# Altium schematic sheet microsmt_pnpboard_v17_sheet_1.schdoc
size 853 x 579 mm
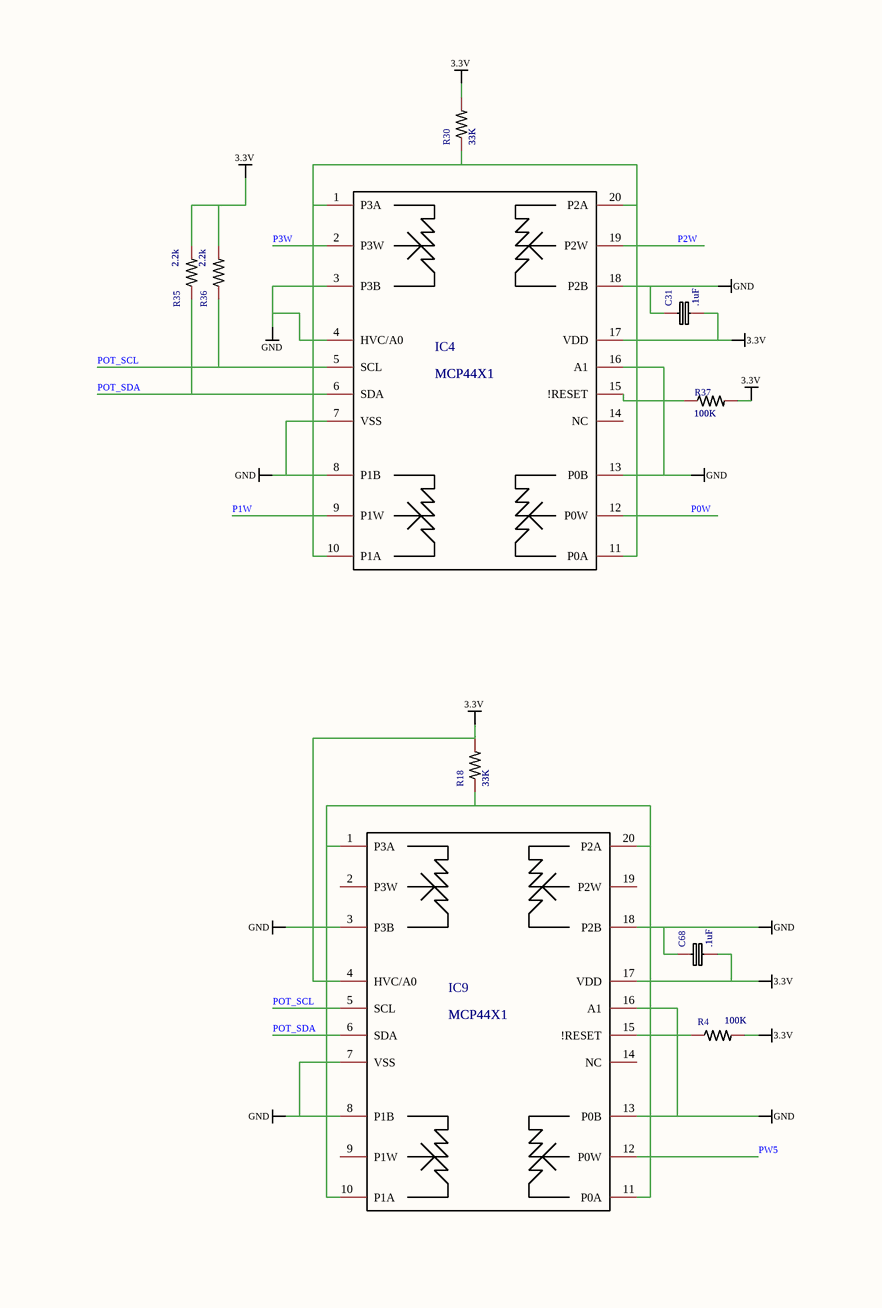
[diagram p0: microsmt_pnpboard_v17_sheet_1.schdoc, top middle]
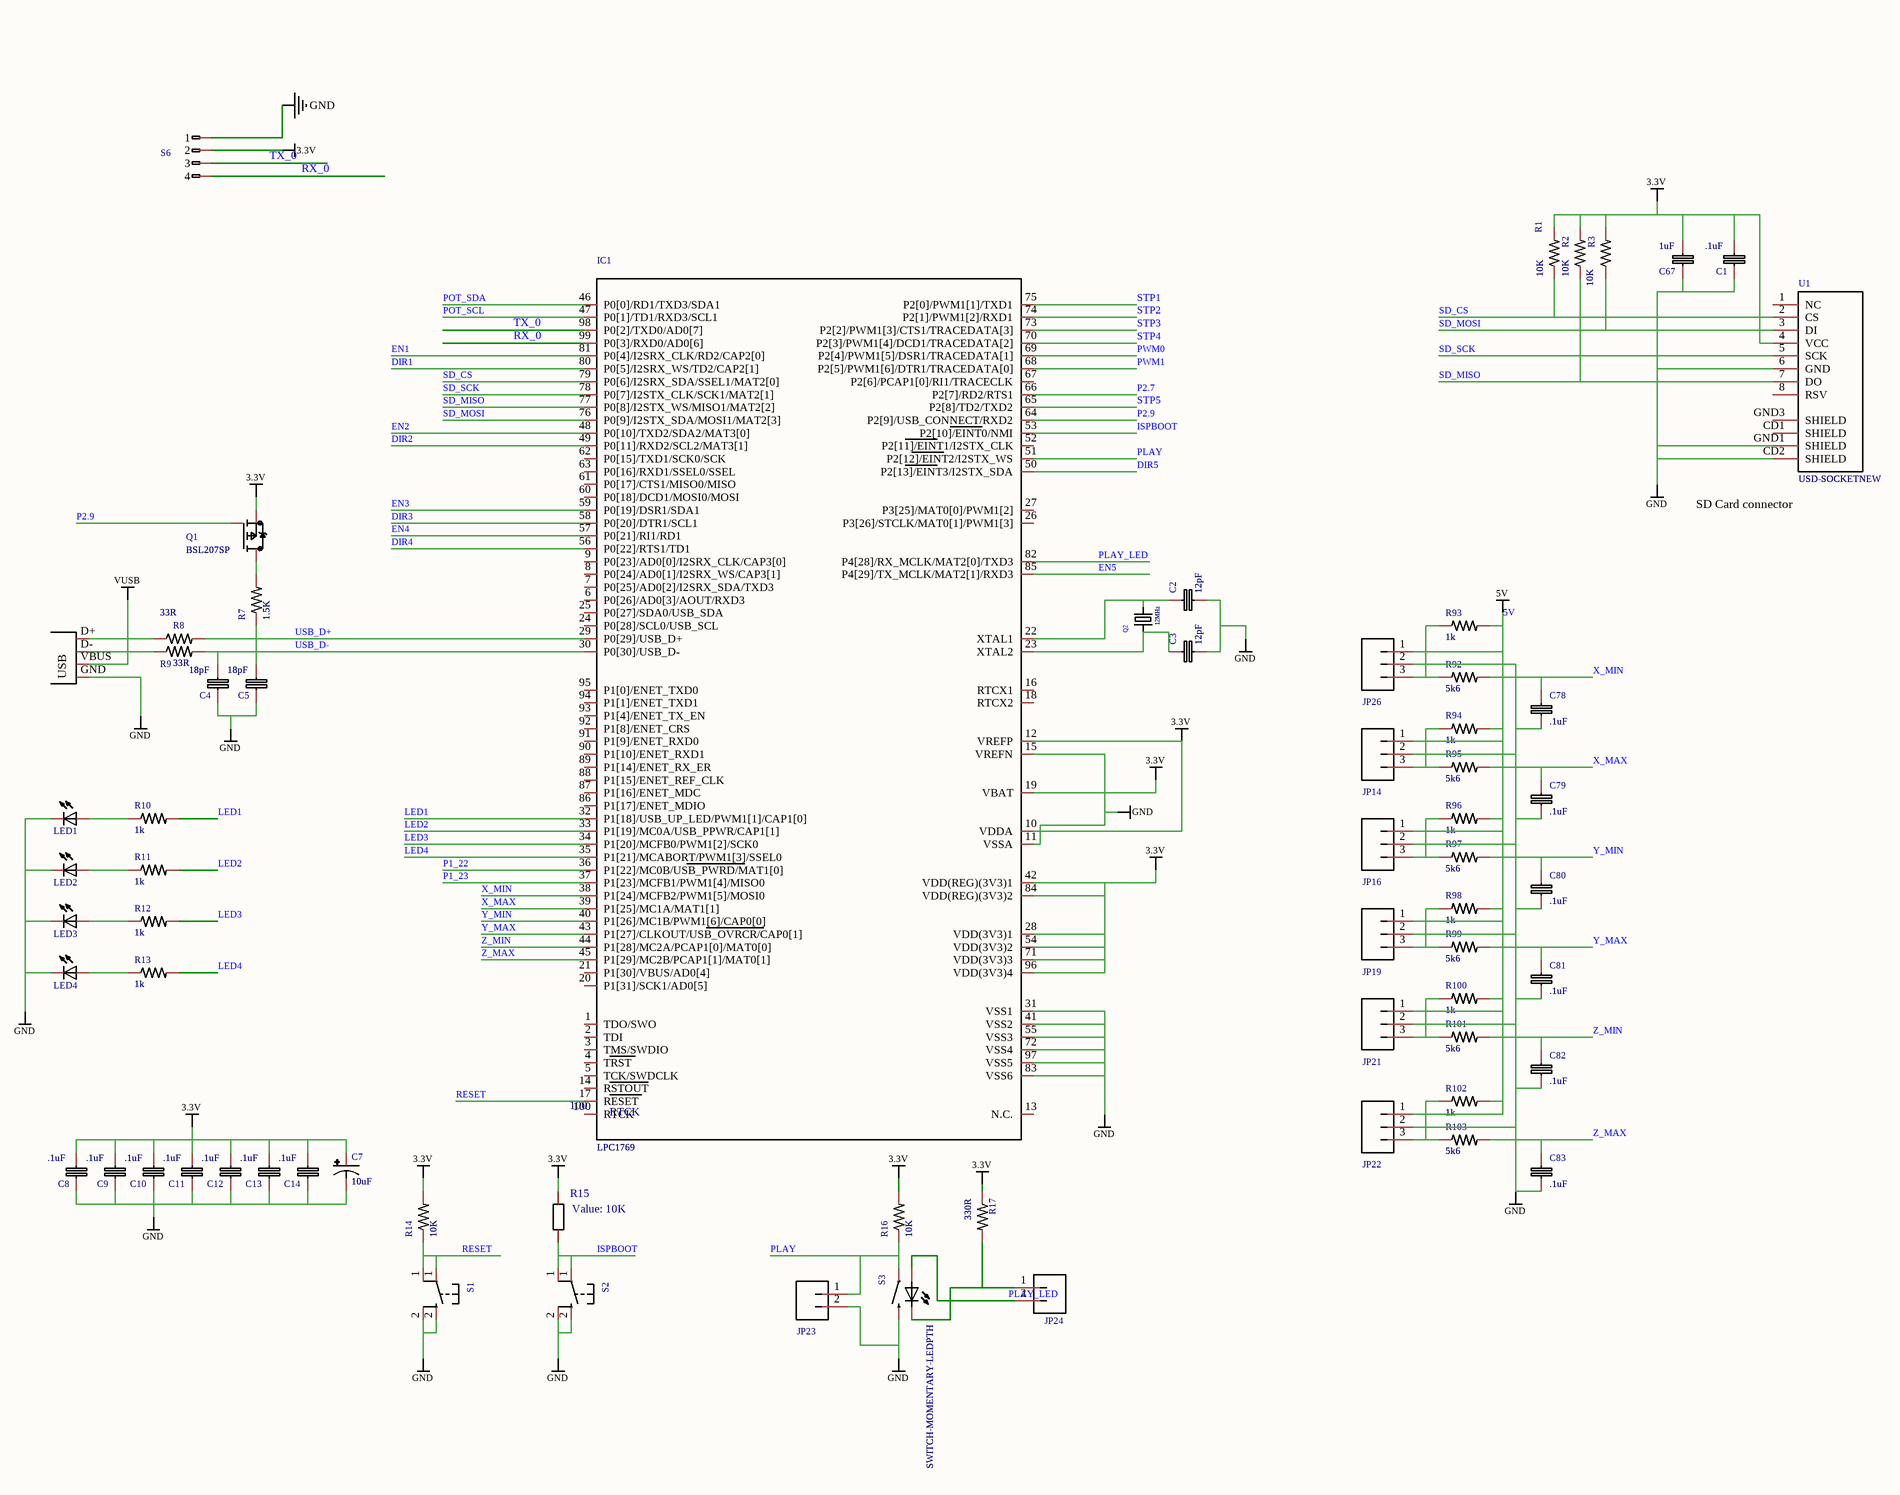
[diagram p1: microsmt_pnpboard_v17_sheet_1.schdoc, top right]
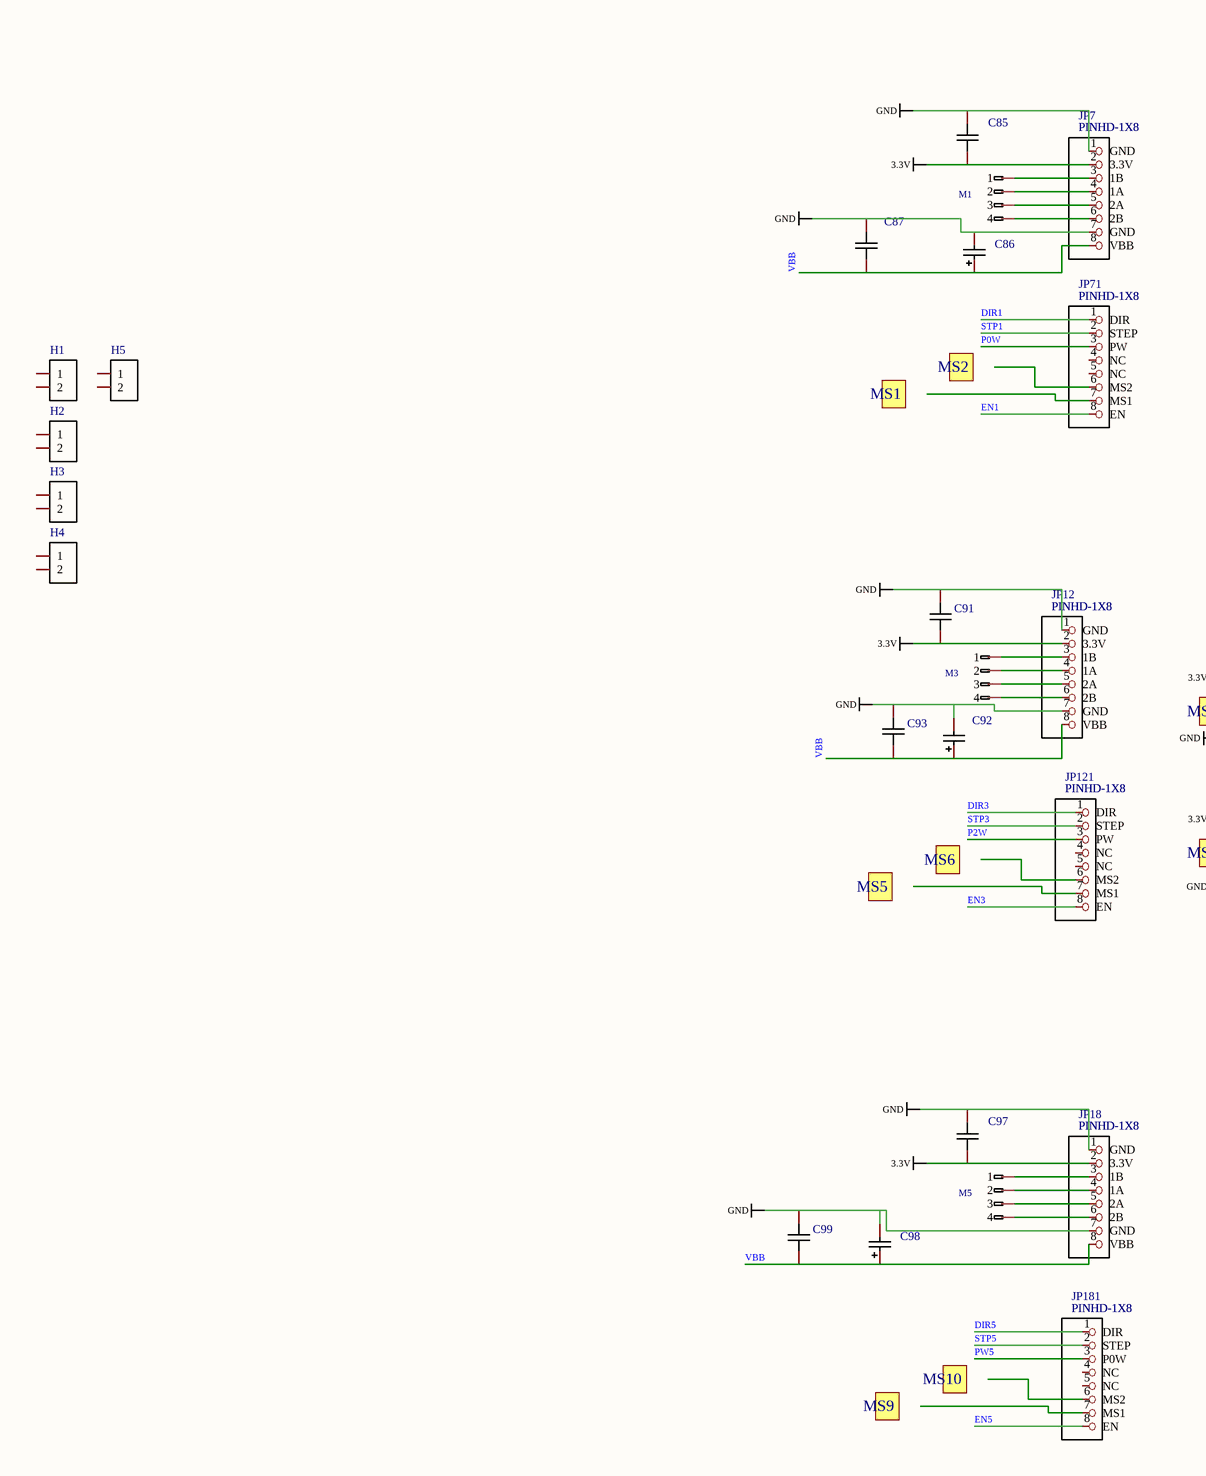
[diagram p2: microsmt_pnpboard_v17_sheet_1.schdoc, bottom left]
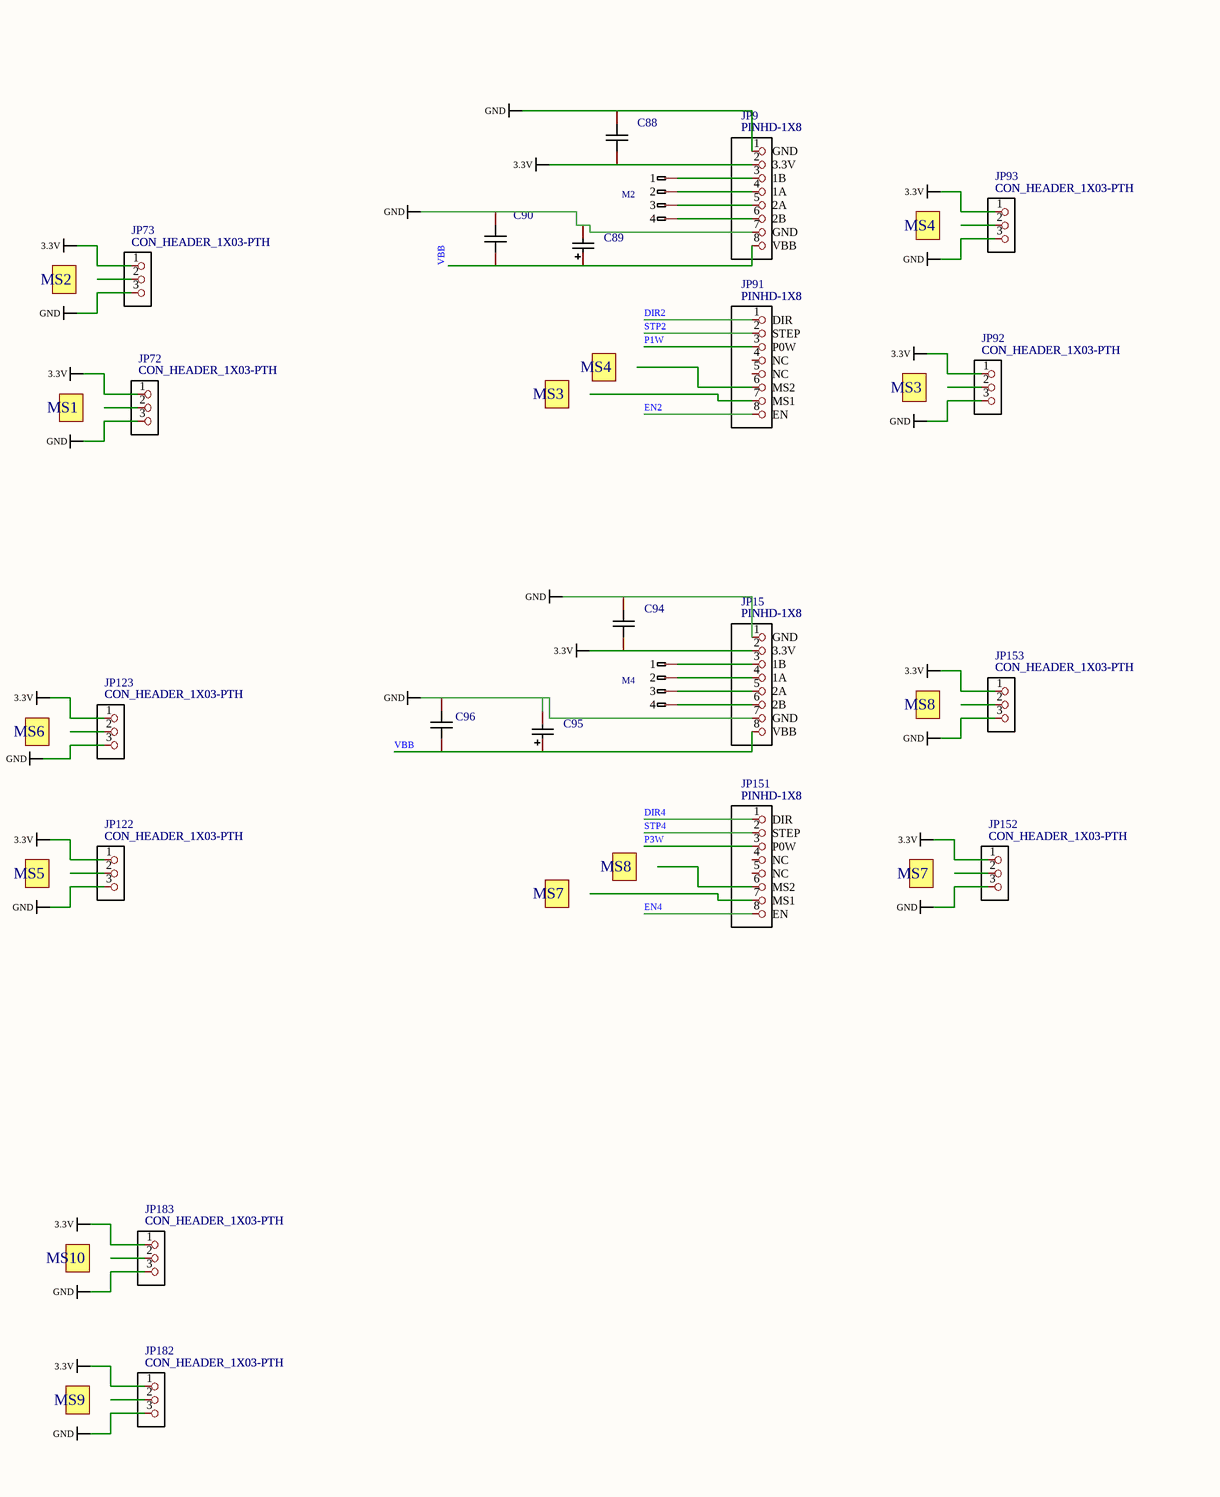
[diagram p3: microsmt_pnpboard_v17_sheet_1.schdoc, bottom middle]

## Parts
C1  .1uF  [R0603]
C2  12pF  [R0603]
C3  12pF  [R0603]
C4  18pF  [R0603]
C5  18pF  [R0603]
C7  10uF  [EIA3216]
C8  .1uF  [R0603]
C9  .1uF  [R0603]
C10  .1uF  [R0603]
C11  .1uF  [R0603]
C12  .1uF  [R0603]
C13  .1uF  [R0603]
C14  .1uF  [R0603]
C31  .1uF  [R0603]
C67  1uF  [R0603]
C68  .1uF  [R0603]
C78  .1uF  [R0603]
C79  .1uF  [R0603]
C80  .1uF  [R0603]
C81  .1uF  [R0603]
C82  .1uF  [R0603]
C83  .1uF  [R0603]
C85  100nF  [R0603]  (value not drawn)
C86  100uF  [贴片铝电解8*10.5]  (value not drawn)
C87  100nF  [R0603]  (value not drawn)
C88  100nF  [R0603]  (value not drawn)
C89  100uF  [贴片铝电解8*10.5]  (value not drawn)
C90  CAP_0603  [R0603]  (value not drawn)
C91  CAP_0603  [R0603]  (value not drawn)
C92  C_Ele_SMD_3x5.4mm  [贴片铝电解8*10.5]  (value not drawn)
C93  100nF  [R0603]  (value not drawn)
C94  100nF  [R0603]  (value not drawn)
C95  100uF  [贴片铝电解8*10.5]  (value not drawn)
C96  100nF  [R0603]  (value not drawn)
C97  100nF  [R0603]  (value not drawn)
C98  100uF  [贴片铝电解8*10.5]  (value not drawn)
C99  100nF  [R0603]  (value not drawn)
H1  HDR-F_2.54_1x2P  [HDR-TH_2P-P2.54-V-F]  (value not drawn)
H2  HDR-F_2.54_1x2P  [HDR-TH_2P-P2.54-V-F]  (value not drawn)
H3  HDR-F_2.54_1x2P  [HDR-TH_2P-P2.54-V-F]  (value not drawn)
H4  HDR-F_2.54_1x2P  [HDR-TH_2P-P2.54-V-F]  (value not drawn)
H5  HDR-F_2.54_1x2P  [HDR-TH_2P-P2.54-V-F]  (value not drawn)
IC1  LPC1769  NAME: RTCK  NUMBER: 100  [LQFP100_14X14]
IC4  MCP44X1  [TSSOP-20_L6.5-W4.4-P0.65-LS6.4-TL]
IC9  MCP44X1  [TSSOP-20_L6.5-W4.4-P0.65-LS6.4-TL]
JP7  PINHD-1X8  [1X08-BIG]
JP9  PINHD-1X8  [1X08-BIG]
JP12  PINHD-1X8  [1X08-BIG]
JP14  M03POLAR  [MOLEX-1X3]  (value not drawn)
JP15  PINHD-1X8  [1X08-BIG]
JP16  M03POLAR  [MOLEX-1X3]  (value not drawn)
JP18  PINHD-1X8  [1X08-BIG]
JP19  M03POLAR  [MOLEX-1X3]  (value not drawn)
JP21  M03POLAR  [MOLEX-1X3]  (value not drawn)
JP22  M03POLAR  [MOLEX-1X3]  (value not drawn)
JP23  M02PTH  [MOLEX-1X2]  (value not drawn)
JP24  M02PTH  [MOLEX-1X2]  (value not drawn)
JP26  M03POLAR  [MOLEX-1X3]  (value not drawn)
JP71  PINHD-1X8  [1X08-BIG]
JP72  CON_HEADER_1X03-PTH  [1X03_NO_SILK]
JP73  CON_HEADER_1X03-PTH  [1X03_NO_SILK]
JP91  PINHD-1X8  [1X08-BIG]
JP92  CON_HEADER_1X03-PTH  [1X03_NO_SILK]
JP93  CON_HEADER_1X03-PTH  [1X03_NO_SILK]
JP121  PINHD-1X8  [1X08-BIG]
JP122  CON_HEADER_1X03-PTH  [1X03_NO_SILK]
JP123  CON_HEADER_1X03-PTH  [1X03_NO_SILK]
JP151  PINHD-1X8  [1X08-BIG]
JP152  CON_HEADER_1X03-PTH  [1X03_NO_SILK]
JP153  CON_HEADER_1X03-PTH  [1X03_NO_SILK]
JP181  PINHD-1X8  [1X08-BIG]
JP182  CON_HEADER_1X03-PTH  [1X03_NO_SILK]
JP183  CON_HEADER_1X03-PTH  [1X03_NO_SILK]
LED1  LEDCHIP-LED0805  [LED0805-RD]  (value not drawn)
LED2  LEDCHIP-LED0805  [LED0805-RD]  (value not drawn)
LED3  LEDCHIP-LED0805  [LED0805-RD]  (value not drawn)
LED4  LEDCHIP-LED0805  [LED0805-RD]  (value not drawn)
M1  10X04MTA  [10X04MTA]  (value not drawn)
M2  10X04MTA  [10X04MTA]  (value not drawn)
M3  10X04MTA  [10X04MTA]  (value not drawn)
M4  10X04MTA  [10X04MTA]  (value not drawn)
M5  10X04MTA  [10X04MTA]  (value not drawn)
Q1  BSL207SP  [TSOP-6_L3.0-W1.5-P0.95-LS2.8-BL]
Q2  12MHz  [3.2*2.5_3225贴片无源晶振]
R1  10K  [R0603]
R2  10K  [R0603]
R3  10K  [R0603]
R4  100K  [R0603]
R7  1.5K  [R0603]
R8  33R  [R0603]
R9  33R  [R0603]
R10  1k  [R0603]
R11  1k  [R0603]
R12  1k  [R0603]
R13  1k  [R0603]
R14  10K  [R0603]
R15  value 10K  [R0603]  (hidden comment: Res_0603)
R16  10K  [R0603]
R17  330R  [R0603]
R18  33K  [R0603]
R30  33K  [R0603]
R35  2.2k  [R0603]
R36  2.2k  [R0603]
R37  100K  [R0603]
R92  5k6  [R0603]
R93  1k  [R0603]
R94  1k  [R0603]
R95  5k6  [R0603]
R96  1k  [R0603]
R97  5k6  [R0603]
R98  1k  [R0603]
R99  5k6  [R0603]
R100  1k  [R0603]
R101  5k6  [R0603]
R102  1k  [R0603]
R103  5k6  [R0603]
S1  TAC_SWITCHSMD  [SW_SPST_B3S-1000]  (value not drawn)
S2  TAC_SWITCHSMD  [SW_SPST_B3S-1000]  (value not drawn)
S3  SWITCH-MOMENTARY-LEDPTH  [TACTILE-PTH-LED-12MM]
S6  10X04MTA  [10X04MTA]  (value not drawn)
U1  USD-SOCKETNEW  [MICRO-SD-SOCKET-PP]
X14  USBPTH  [USB-B-PTH]  (value not drawn)

## Ports
MS1 (out), MS2 (out), MS3 (out), MS4 (out), MS5 (out), MS6 (out), MS7 (out), MS8 (out), MS9 (out), MS10 (out)

## Nets
3.3V: C1.2 C7.A(+) C8.2 C9.2 C10.2 C11.2 C12.2 C13.2 C14.2 C31.2 C67.2 C68.2 C85.1 C88.1 C91.1 C94.1 C97.1 IC1.10(VDDA) IC1.12(VREFP) IC1.19(VBAT) IC1.28(VDD(3V3)1) IC1.42(VDD(REG)(3V3)1) IC1.54(VDD(3V3)2) IC1.71(VDD(3V3)3) IC1.84(VDD(REG)(3V3)2) IC1.96(VDD(3V3)4) IC4.17(VDD) IC9.4(HVC/A0) IC9.17(VDD) JP7.2(3.3V) JP9.2(3.3V) JP12.2(3.3V) JP15.2(3.3V) JP18.2(3.3V) JP72.1 JP73.1 JP92.1 JP93.1 JP122.1 JP123.1 JP152.1 JP153.1 JP182.1 JP183.1 Q1.4(S) R1.2 R2.2 R3.2 R4.2 R14.2 R15.2 R16.2 R17.1 R18.2 R30.2 R35.2 R36.2 R37.2 S6.2 U1.4(VCC)
5V: JP14.1 JP16.1 JP19.1 JP21.1 JP22.1 JP26.1 R93.2 R94.2 R96.2 R98.2 R100.2 R102.2
GND: C1.1 C2.2 C3.2 C4.1 C5.1 C7.C(-) C8.1 C9.1 C10.1 C11.1 C12.1 C13.1 C14.1 C31.1 C67.1 C68.1 C78.2 C79.2 C80.2 C81.2 C82.2 C83.2 C85.2 C86.2 C87.2 C88.2 C89.2 C90.2 C91.2 C92.2 C93.2 C94.2 C95.2 C96.2 C97.2 C98.2 C99.2 IC1.11(VSSA) IC1.15(VREFN) IC1.31(VSS1) IC1.41(VSS2) IC1.55(VSS3) IC1.72(VSS4) IC1.83(VSS6) IC1.97(VSS5) IC4.3(P3B) IC4.4(HVC/A0) IC4.7(VSS) IC4.8(P1B) IC4.13(P0B) IC4.16(A1) IC4.18(P2B) IC9.3(P3B) IC9.7(VSS) IC9.8(P1B) IC9.13(P0B) IC9.16(A1) IC9.18(P2B) JP7.1(GND) JP7.7(GND) JP9.1(GND) JP9.7(GND) JP12.1(GND) JP12.7(GND) JP14.2 JP15.1(GND) JP15.7(GND) JP16.2 JP18.1(GND) JP18.7(GND) JP19.2 JP21.2 JP22.2 JP23.2 JP26.2 JP72.3 JP73.3 JP92.3 JP93.3 JP122.3 JP123.3 JP152.3 JP153.3 JP182.3 JP183.3 LED1.1 LED2.1 LED3.1 LED4.1 S1.2 S2.2 S3.2 S6.1 U1.6(GND) U1.CD2(SHIELD) U1.GND1(SHIELD) X14.GND
VUSB: X14.VBUS
DIR1: IC1.80(P0[5]/I2SRX_WS/TD2/CAP2[1]) JP71.1(DIR)
DIR2: IC1.49(P0[11]/RXD2/SCL2/MAT3[1]) JP91.1(DIR)
DIR3: IC1.58(P0[20]/DTR1/SCL1) JP121.1(DIR)
DIR4: IC1.56(P0[22]/RTS1/TD1) JP151.1(DIR)
DIR5: IC1.50(P2[13]/EINT3/I2STX_SDA) JP181.1(DIR)
EN1: IC1.81(P0[4]/I2SRX_CLK/RD2/CAP2[0]) JP71.8(EN)
EN2: IC1.48(P0[10]/TXD2/SDA2/MAT3[0]) JP91.8(EN)
EN3: IC1.59(P0[19]/DSR1/SDA1) JP121.8(EN)
EN4: IC1.57(P0[21]/RI1/RD1) JP151.8(EN)
EN5: IC1.85(P4[29]/TX_MCLK/MAT2[1]/RXD3) JP181.8(EN)
ISPBOOT: IC1.53(P2[10]/EINT0/NMI) R15.1 S2.1
LED1: IC1.32(P1[18]/USB_UP_LED/PWM1[1]/CAP1[0]) R10.2
LED2: IC1.33(P1[19]/MC0A/USB_PPWR/CAP1[1]) R11.2
LED3: IC1.34(P1[20]/MCFB0/PWM1[2]/SCK0) R12.2
LED4: IC1.35(P1[21]/MCABORT/PWM1[3]/SSEL0) R13.2
P0W: IC4.12(P0W) JP71.3(PW)
P1_22: IC1.36(P1[22]/MC0B/USB_PWRD/MAT1[0])
P1_23: IC1.37(P1[23]/MCFB1/PWM1[4]/MISO0)
P1W: IC4.9(P1W) JP91.3(P0W)
P2.7: IC1.66(P2[7]/RD2/RTS1)
P2.9: IC1.64(P2[9]/USB_CONNECT/RXD2) Q1.3(G)
P2W: IC4.19(P2W) JP121.3(PW)
P3W: IC4.2(P3W) JP151.3(P0W)
PLAY: IC1.51(P2[12]/EINT2/I2STX_WS) JP23.1 R16.1 S3.4
PLAY_LED: IC1.82(P4[28]/RX_MCLK/MAT2[0]/TXD3) JP24.2 S3.A
POT_SCL: IC1.47(P0[1]/TD1/RXD3/SCL1) IC4.5(SCL) IC9.5(SCL) R36.1
POT_SDA: IC1.46(P0[0]/RD1/TXD3/SDA1) IC4.6(SDA) IC9.6(SDA) R35.1
PW5: IC9.12(P0W) JP181.3(P0W)
PWM0: IC1.69(P2[4]/PWM1[5]/DSR1/TRACEDATA[1])
PWM1: IC1.68(P2[5]/PWM1[6]/DTR1/TRACEDATA[0])
RESET: IC1.17(RESET) R14.1 S1.1
RX_0: IC1.99(P0[3]/RXD0/AD0[6]) S6.4
SD_CS: IC1.79(P0[6]/I2SRX_SDA/SSEL1/MAT2[0]) R1.1 U1.2(CS)
SD_MISO: IC1.77(P0[8]/I2STX_WS/MISO1/MAT2[2]) R2.1 U1.7(DO)
SD_MOSI: IC1.76(P0[9]/I2STX_SDA/MOSI1/MAT2[3]) R3.1 U1.3(DI)
SD_SCK: IC1.78(P0[7]/I2STX_CLK/SCK1/MAT2[1]) U1.5(SCK)
STP1: IC1.75(P2[0]/PWM1[1]/TXD1) JP71.2(STEP)
STP2: IC1.74(P2[1]/PWM1[2]/RXD1) JP91.2(STEP)
STP3: IC1.73(P2[2]/PWM1[3]/CTS1/TRACEDATA[3]) JP121.2(STEP)
STP4: IC1.70(P2[3]/PWM1[4]/DCD1/TRACEDATA[2]) JP151.2(STEP)
STP5: IC1.65(P2[8]/TD2/TXD2) JP181.2(STEP)
TX_0: IC1.98(P0[2]/TXD0/AD0[7]) S6.3
USB_D+: C5.2 IC1.29(P0[29]/USB_D+) R7.1 R8.2
USB_D-: C4.2 IC1.30(P0[30]/USB_D-) R9.2
VBB: C86.1 C87.1 C89.1 C90.1 C92.1 C93.1 C95.1 C96.1 C98.1 C99.1 JP7.8(VBB) JP9.8(VBB) JP12.8(VBB) JP15.8(VBB) JP18.8(VBB)
X_MAX: C79.1 IC1.39(P1[25]/MC1A/MAT1[1]) R95.2
X_MIN: C78.1 IC1.38(P1[24]/MCFB2/PWM1[5]/MOSI0) R92.2
Y_MAX: C81.1 IC1.43(P1[27]/CLKOUT/USB_OVRCR/CAP0[1]) R99.2
Y_MIN: C80.1 IC1.40(P1[26]/MC1B/PWM1[6]/CAP0[0]) R97.2
Z_MAX: C83.1 IC1.45(P1[29]/MC2B/PCAP1[1]/MAT0[1]) R103.2
Z_MIN: C82.1 IC1.44(P1[28]/MC2A/PCAP1[0]/MAT0[0]) R101.2
NetC2_1: C2.1 IC1.22(XTAL1) Q2.3
NetC3_1: C3.1 IC1.23(XTAL2) Q2.1
NetIC4_1: IC4.1(P3A) IC4.10(P1A) IC4.11(P0A) IC4.20(P2A) R30.1
NetIC4_15: IC4.15(!RESET) R37.1
NetIC9_1: IC9.1(P3A) IC9.10(P1A) IC9.11(P0A) IC9.20(P2A) R18.1
NetIC9_15: IC9.15(!RESET) R4.1
NetJP7_3: JP7.3(1B) M1.1
NetJP7_4: JP7.4(1A) M1.2
NetJP7_5: JP7.5(2A) M1.3
NetJP7_6: JP7.6(2B) M1.4
NetJP9_3: JP9.3(1B) M2.1
NetJP9_4: JP9.4(1A) M2.2
NetJP9_5: JP9.5(2A) M2.3
NetJP9_6: JP9.6(2B) M2.4
NetJP12_3: JP12.3(1B) M3.1
NetJP12_4: JP12.4(1A) M3.2
NetJP12_5: JP12.5(2A) M3.3
NetJP12_6: JP12.6(2B) M3.4
NetJP14_3: JP14.3 R94.1 R95.1
NetJP15_3: JP15.3(1B) M4.1
NetJP15_4: JP15.4(1A) M4.2
NetJP15_5: JP15.5(2A) M4.3
NetJP15_6: JP15.6(2B) M4.4
NetJP16_3: JP16.3 R96.1 R97.1
NetJP18_3: JP18.3(1B) M5.1
NetJP18_4: JP18.4(1A) M5.2
NetJP18_5: JP18.5(2A) M5.3
NetJP18_6: JP18.6(2B) M5.4
NetJP19_3: JP19.3 R98.1 R99.1
NetJP21_3: JP21.3 R100.1 R101.1
NetJP22_3: JP22.3 R102.1 R103.1
NetJP24_1: JP24.1 R17.2 S3.C
NetJP26_3: JP26.3 R92.1 R93.1
NetLED1_2: LED1.2 R10.1
NetLED2_2: LED2.2 R11.1
NetLED3_2: LED3.2 R12.1
NetLED4_2: LED4.2 R13.1
NetQ1_1: Q1.1(D) Q1.2(D) Q1.5(D) Q1.6(D) R7.2
NetR8_1: R8.1 X14.D+
NetR9_1: R9.1 X14.D-

Not connected (* = marked no-connect by the designer): H1 1 2; H2 1 2; H3 1 2; H4 1 2; H5 1 2; IC1 1(TDO/SWO) 2(TDI) 3(TMS/SWDIO) 4(TRST) 5(TCK/SWDCLK) 6(P0[26]/AD0[3]/AOUT/RXD3) 7(P0[25]/AD0[2]/I2SRX_SDA/TXD3) 8(P0[24]/AD0[1]/I2SRX_WS/CAP3[1]) 9(P0[23]/AD0[0]/I2SRX_CLK/CAP3[0]) 13(N.C.) 14(RSTOUT) 16(RTCX1) 18(RTCX2) 20(P1[31]/SCK1/AD0[5]) 21(P1[30]/VBUS/AD0[4]) 24(P0[28]/SCL0/USB_SCL) 25(P0[27]/SDA0/USB_SDA) 26(P3[26]/STCLK/MAT0[1]/PWM1[3]) 27(P3[25]/MAT0[0]/PWM1[2]) 52(P2[11]/EINT1/I2STX_CLK) 60(P0[18]/DCD1/MOSI0/MOSI) 61(P0[17]/CTS1/MISO0/MISO) 62(P0[15]/TXD1/SCK0/SCK) 63(P0[16]/RXD1/SSEL0/SSEL) 67(P2[6]/PCAP1[0]/RI1/TRACECLK) 86(P1[17]/ENET_MDIO) 87(P1[16]/ENET_MDC) 88(P1[15]/ENET_REF_CLK) 89(P1[14]/ENET_RX_ER) 90(P1[10]/ENET_RXD1) 91(P1[9]/ENET_RXD0) 92(P1[8]/ENET_CRS) 93(P1[4]/ENET_TX_EN) 94(P1[1]/ENET_TXD1) 95(P1[0]/ENET_TXD0) 100(RTCK); IC4 14(NC); IC9 2(P3W) 9(P1W) 14(NC) 19(P2W); JP71 4(NC) 5(NC) 6(MS2) 7(MS1); JP72 2; JP73 2; JP91 4(NC) 5(NC) 6(MS2) 7(MS1); JP92 2; JP93 2; JP121 4(NC) 5(NC) 6(MS2) 7(MS1); JP122 2; JP123 2; JP151 4(NC) 5(NC) 6(MS2) 7(MS1); JP152 2; JP153 2; JP181 4(NC) 5(NC) 6(MS2) 7(MS1); JP182 2; JP183 2; U1 1(NC) 8(RSV) CD1(SHIELD) GND3(SHIELD)

## Notes on the sheet
- (near U1) SD Card connector
- (in symbol USBPTH) USB

## Library data of the parts
C1 C8-C14 C31 C68 C78-C83 = .1uF: Convert to PCB: yes; Name: .1uF; Symbol: .1uF; Device: .1uF; Add into BOM: yes; Origin Footprint: R0603
C2 C3 = 12pF: Convert to PCB: yes; Name: 12pF; Symbol: 12pF; Device: 12pF; Add into BOM: yes; Origin Footprint: R0603
C4 C5 = 18pF: Convert to PCB: yes; Name: 18pF; Symbol: 18pF; Device: 18pF; Add into BOM: yes; Origin Footprint: R0603
C7 = 10uF: Convert to PCB: yes; Name: 10uF; Symbol: 10uF; Device: 10uF; Add into BOM: yes; Origin Footprint: EIA3216
C67 = 1uF: Convert to PCB: yes; Name: 1uF; Symbol: 1uF; Device: 1uF; Add into BOM: yes; Origin Footprint: R0603
C85 C87 C88 C93 C94 C96 C97 C99 = CAP_0603: 容值:100nF;精度:±10%;额定电压:50V;温度系数:X7R;; Symbol: C1210X7R475K630NT; Convert to PCB: yes; Name: 100nF; Device: CAP_0603; Add into BOM: yes; Supplier Footprint: 0603; Value: 100nF
C86 C89 C95 C98 = C_Ele_SMD_3x5.4mm: 容值:10uF;精度:±20%;额定电压:16V;电容体直径:-;电容体长度:-;纹波电流:-;等效串联电阻:-;工作寿命:2000hrs@85;工作温度:-40~+85;; Symbol: CAP; Add into BOM: yes; Value: 10uF; Name: 100uF; Device: C_Ele_SMD_3x5.4mm; Supplier Footprint: SMD,3x5.4mm; Convert to PCB: yes
C90 C91 = CAP_0603: 容值:100nF;精度:±10%;额定电压:50V;温度系数:X7R;; Name: 100nF; Symbol: C1210X7R475K630NT; Convert to PCB: yes; Value: 100nF; Device: CAP_0603; Add into BOM: yes; Supplier Footprint: 0603
C92 = C_Ele_SMD_3x5.4mm: 容值:10uF;精度:±20%;额定电压:16V;电容体直径:-;电容体长度:-;纹波电流:-;等效串联电阻:-;工作寿命:2000hrs@85;工作温度:-40~+85;; Name: 10uF; Symbol: CAP; Add into BOM: yes; Value: 10uF; Device: C_Ele_SMD_3x5.4mm; Supplier Footprint: SMD,3x5.4mm; Convert to PCB: yes
H1-H5 = HDR-F_2.54_1x2P: Symbol: Header-Female-2.54_1x2; Convert to PCB: yes; Device: HDR-F_2.54_1x2P; Add into BOM: yes; Supplier Part: C49661; Supplier Footprint: 插件
IC1 = LPC1769: Convert to PCB: yes; Name: LPC1769; Symbol: LPC1769; Device: LPC1769; Add into BOM: yes; Origin Footprint: LQFP100_14X14
IC4 IC9 = MCP44X1: Convert to PCB: yes; Name: MCP44X1; Symbol: MCP44X1; Device: MCP44X1; Add into BOM: yes; Origin Footprint: TSSOP-20_L6.5-W4.4-P0.65-LS6.4-TL
JP7 JP9 JP12 JP15 JP18 JP71 JP91 JP121 JP151 JP181 = PINHD-1X8: Convert to PCB: yes; Name: PINHD-1X8; Symbol: PINHD-1X8; Device: PINHD-1X8; Add into BOM: yes; Origin Footprint: 1X08-BIG
JP14 JP16 JP19 JP21 JP22 JP26 = M03POLAR: Convert to PCB: yes; Name: M03POLAR; Symbol: M03POLAR; Device: M03POLAR; Add into BOM: yes; Origin Footprint: MOLEX-1X3
JP23 JP24 = M02PTH: Convert to PCB: yes; Name: M02PTH; Symbol: M02PTH; Device: M02PTH; Add into BOM: yes; Origin Footprint: MOLEX-1X2
JP72 JP73 JP92 JP93 JP122 JP123 JP152 JP153 JP182 JP183 = CON_HEADER_1X03-PTH: Convert to PCB: yes; Name: CON_HEADER_1X03-PTH; Symbol: CON_HEADER_1X03-PTH; Device: CON_HEADER_1X03-PTH; Add into BOM: yes; Origin Footprint: 1X03_NO_SILK
LED1-LED4 = LEDCHIP-LED0805: Convert to PCB: yes; Name: LEDCHIP-LED0805; Symbol: LEDCHIP-LED0805; Device: LEDCHIP-LED0805; Add into BOM: yes; Origin Footprint: LED0805-RD
M1-M5 = 10X04MTA: Convert to PCB: yes; Name: 10X04MTA; Symbol: 10X04MTA; Device: 10X04MTA; Add into BOM: yes; Origin Footprint: 10X04MTA
Q1 = BSL207SP: Convert to PCB: yes; Name: BSL207SP; Symbol: BSL207SP; Device: BSL207SP; Add into BOM: yes; Origin Footprint: TSOP-6_L3.0-W1.5-P0.95-LS2.8-BL
Q2 = 12MHz: Convert to PCB: yes; Name: 12MHz; Symbol: 12MHz; Device: 12MHz; Add into BOM: yes; Origin Footprint: 3.2*2.5_3225贴片无源晶振
R1-R3 R14 R16 = 10K: Convert to PCB: yes; Name: 10K; Symbol: 10K; Device: 10K; Add into BOM: yes; Origin Footprint: R0603
R4 R37 = 100K: Convert to PCB: yes; Name: 100K; Symbol: 100K; Device: 100K; Add into BOM: yes; Origin Footprint: R0603
R7 = 1.5K: Convert to PCB: yes; Name: 1.5K; Symbol: 1.5K; Device: 1.5K; Add into BOM: yes; Origin Footprint: R0603
R8 R9 = 33R: Convert to PCB: yes; Name: 33R; Symbol: 33R; Device: 33R; Add into BOM: yes; Origin Footprint: R0603
R10-R13 R93 R94 R96 R98 R100 R102 = 1k: Convert to PCB: yes; Name: 1k; Symbol: 1k; Device: 1k; Add into BOM: yes; Origin Footprint: R0603
R15 = Res_0603: Symbol: 电阻; Convert to PCB: yes; Name: 10K; Device: Res_0603; Add into BOM: yes; Supplier Footprint: 0603
R17 = 330R: Convert to PCB: yes; Name: 330R; Symbol: 330R; Device: 330R; Add into BOM: yes; Origin Footprint: R0603
R18 R30 = 33K: Convert to PCB: yes; Name: 33K; Symbol: 33K; Device: 33K; Add into BOM: yes; Origin Footprint: R0603
R35 R36 = 2.2k: Convert to PCB: yes; Name: 2.2k; Symbol: 2.2k; Device: 2.2k; Add into BOM: yes; Origin Footprint: R0603
R92 R95 R97 R99 R101 R103 = 5k6: Convert to PCB: yes; Name: 5k6; Symbol: 5k6; Device: 5k6; Add into BOM: yes; Origin Footprint: R0603
S1 = TAC_SWITCHSMD: Convert to PCB: yes; Name: TAC_SWITCHSMD; Symbol: TAC_SWITCHSMD; Device: TAC_SWITCHSMD; Add into BOM: yes; Origin Footprint: SW_SPST_B3S-1000
S2 = TAC_SWITCHSMD: Convert to PCB: yes; NAME: 1; Name: TAC_SWITCHSMD; Symbol: TAC_SWITCHSMD; Device: TAC_SWITCHSMD; Add into BOM: yes; Origin Footprint: SW_SPST_B3S-1000
S3 = SWITCH-MOMENTARY-LEDPTH: Convert to PCB: yes; Name: SWITCH-MOMENTARY-LEDPTH; Symbol: SWITCH-MOMENTARY-LEDPTH; Device: SWITCH-MOMENTARY-LEDPTH; Add into BOM: yes; Origin Footprint: TACTILE-PTH-LED-12MM
S6 = 10X04MTA: Convert to PCB: yes; NUMBER: 4; Name: 10X04MTA; Symbol: 10X04MTA; Device: 10X04MTA; Add into BOM: yes; Origin Footprint: 10X04MTA
U1 = USD-SOCKETNEW: Convert to PCB: yes; Name: USD-SOCKETNEW; Symbol: USD-SOCKETNEW; Device: USD-SOCKETNEW; Add into BOM: yes; Origin Footprint: MICRO-SD-SOCKET-PP
X14 = USBPTH: Convert to PCB: yes; Name: USBPTH; Symbol: USBPTH; Device: USBPTH; Add into BOM: yes; Origin Footprint: USB-B-PTH